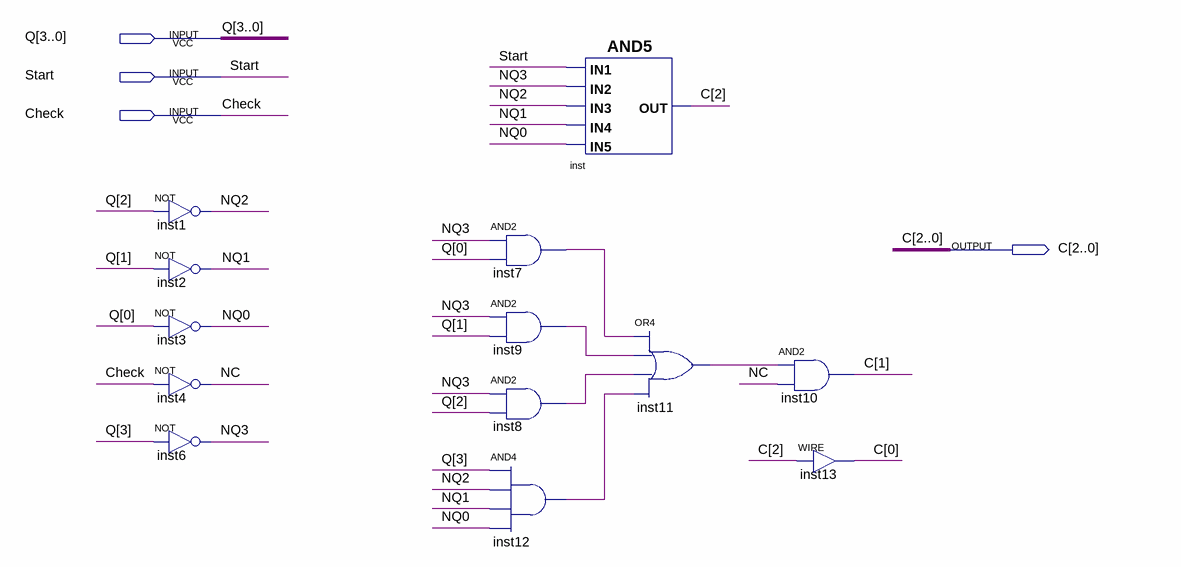
[diagram p0: schematic sheet]
// Quartus schematic OutputBlock.bdf as structural Verilog: 13 symbols, 4 pins
module OutputBlock (
  input  [3:0] Q,
  input  Start,
  input  Check,
  output [2:0] C
);

  wire inst7_out, inst8_out, inst9_out, inst11_out, inst12_out, NC, NQ0, NQ1, NQ2, NQ3;

  not inst1 (NQ2, Q[2]);
  not inst2 (NQ1, Q[1]);
  not inst3 (NQ0, Q[0]);
  not inst4 (NC, Check);
  not inst6 (NQ3, Q[3]);
  and inst7 (inst7_out, NQ3, Q[0]);
  and inst9 (inst9_out, NQ3, Q[1]);
  and inst8 (inst8_out, NQ3, Q[2]);
  and inst12 (inst12_out, Q[3], NQ2, NQ1, NQ0);
  and inst (C[2], Start, NQ3, NQ2, NQ1, NQ0);
  or inst11 (inst11_out, inst7_out, inst9_out, inst8_out, inst12_out);
  and inst10 (C[1], inst11_out, NC);
  assign C[0] = C[2];  // WIRE inst13
endmodule
